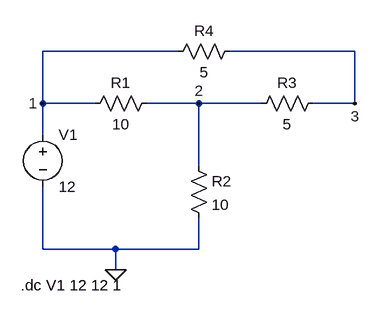
[diagram p0: schematic Draft1.asc]
Draft1.asc, the LTspice schematic file:
Version 4
SHEET 1 880 680
WIRE 128 -112 -80 -112
WIRE 400 -112 208 -112
WIRE -80 -32 -80 -112
WIRE 0 -32 -80 -32
WIRE 160 -32 80 -32
WIRE 256 -32 160 -32
WIRE 400 -32 400 -112
WIRE 400 -32 336 -32
WIRE -80 16 -80 -32
WIRE 160 64 160 -32
WIRE -80 192 -80 96
WIRE 32 192 -80 192
WIRE 160 192 160 144
WIRE 160 192 32 192
WIRE 32 224 32 192
FLAG 32 224 0
FLAG -80 -32 1
FLAG 160 -32 2
FLAG 400 -32 3
SYMBOL voltage -80 0 R0
WINDOW 123 0 0 Left 0
WINDOW 39 0 0 Left 0
SYMATTR InstName V1
SYMATTR Value 12
SYMBOL res 96 -48 R90
WINDOW 0 0 56 VBottom 2
WINDOW 3 32 56 VTop 2
SYMATTR InstName R1
SYMATTR Value 10
SYMBOL res 224 -128 R90
WINDOW 0 0 56 VBottom 2
WINDOW 3 32 56 VTop 2
SYMATTR InstName R4
SYMATTR Value 5
SYMBOL res 352 -48 R90
WINDOW 0 0 56 VBottom 2
WINDOW 3 32 56 VTop 2
SYMATTR InstName R3
SYMATTR Value 5
SYMBOL res 144 48 R0
SYMATTR InstName R2
SYMATTR Value 10
TEXT -114 248 Left 2 !.dc V1 12 12 1

The netlist it stands for:
* Draft1.asc
V1 1 0 12
R1 2 1 10
R4 3 1 5
R3 3 2 5
R2 2 0 10
.dc V1 12 12 1
.backanno
.end

* Results of the author's LTspice run, read from the files saved beside the schematic
* DC transfer characteristic:
*   v1 = 12 
*   V(1) = 12 V
*   V(2) = 8 V
*   V(3) = 10 V
*   I(R2) = 800 mA
*   I(R3) = 400 mA
*   I(R4) = -400 mA
*   I(R1) = -400 mA
*   I(V1) = -800 mA